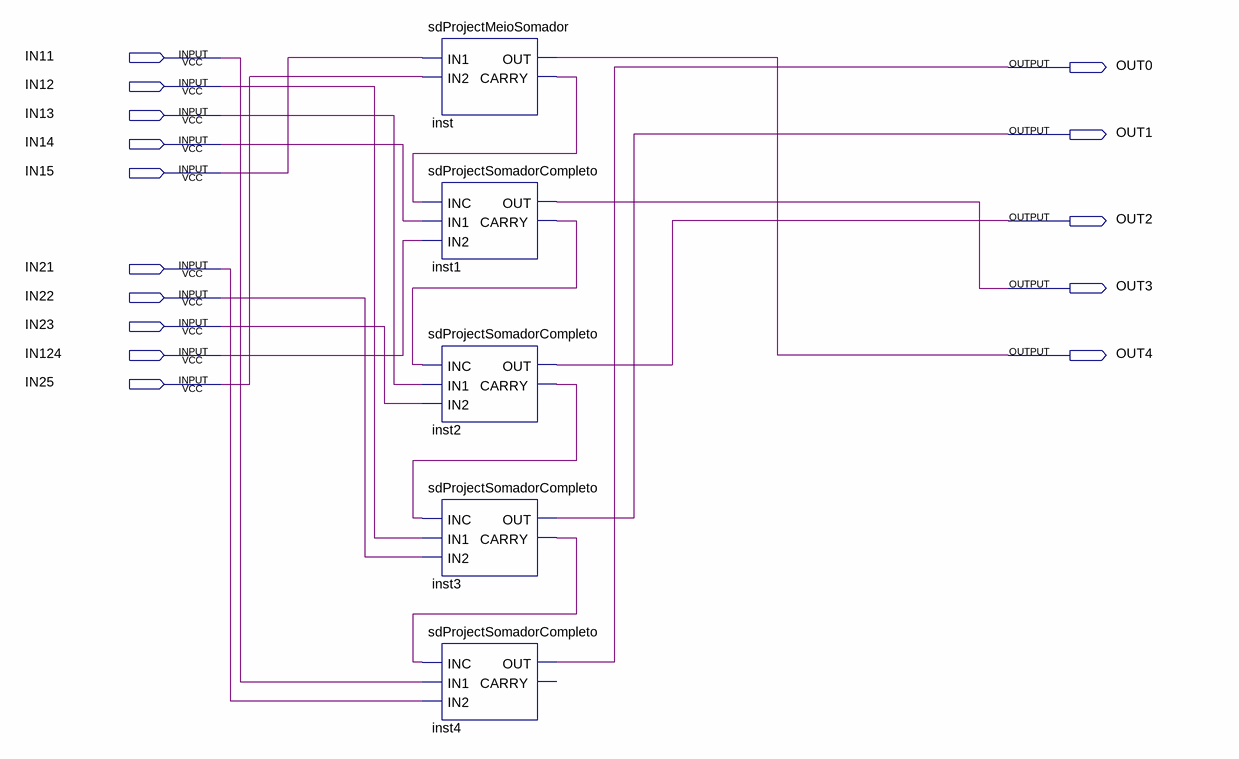
[diagram p0: schematic sheet]
// Quartus schematic sdProjectSomador.bdf as structural Verilog: 5 symbols, 15 pins
module sdProjectSomador (
  input  IN11,
  input  IN12,
  input  IN13,
  input  IN14,
  input  IN15,
  input  IN21,
  input  IN22,
  input  IN23,
  input  IN124,
  input  IN25,
  output OUT0,
  output OUT1,
  output OUT2,
  output OUT3,
  output OUT4
);

  wire inst1_carry, inst2_carry, inst3_carry, inst_carry;

  sdProjectMeioSomador inst (.IN1(IN15), .IN2(IN25), .OUT(OUT4), .CARRY(inst_carry));
  sdProjectSomadorCompleto inst1 (.INC(inst_carry), .IN1(IN14), .IN2(IN124), .OUT(OUT3), .CARRY(inst1_carry));
  sdProjectSomadorCompleto inst2 (.INC(inst1_carry), .IN1(IN13), .IN2(IN23), .OUT(OUT2), .CARRY(inst2_carry));
  sdProjectSomadorCompleto inst3 (.INC(inst2_carry), .IN1(IN12), .IN2(IN22), .OUT(OUT1), .CARRY(inst3_carry));
  sdProjectSomadorCompleto inst4 (.INC(inst3_carry), .IN1(IN11), .IN2(IN21), .OUT(OUT0));  // open: CARRY
endmodule
